# EAGLE design project_vostok_(tv_b_gone_extended)_v1.1 (EAGLE 9.2.0)
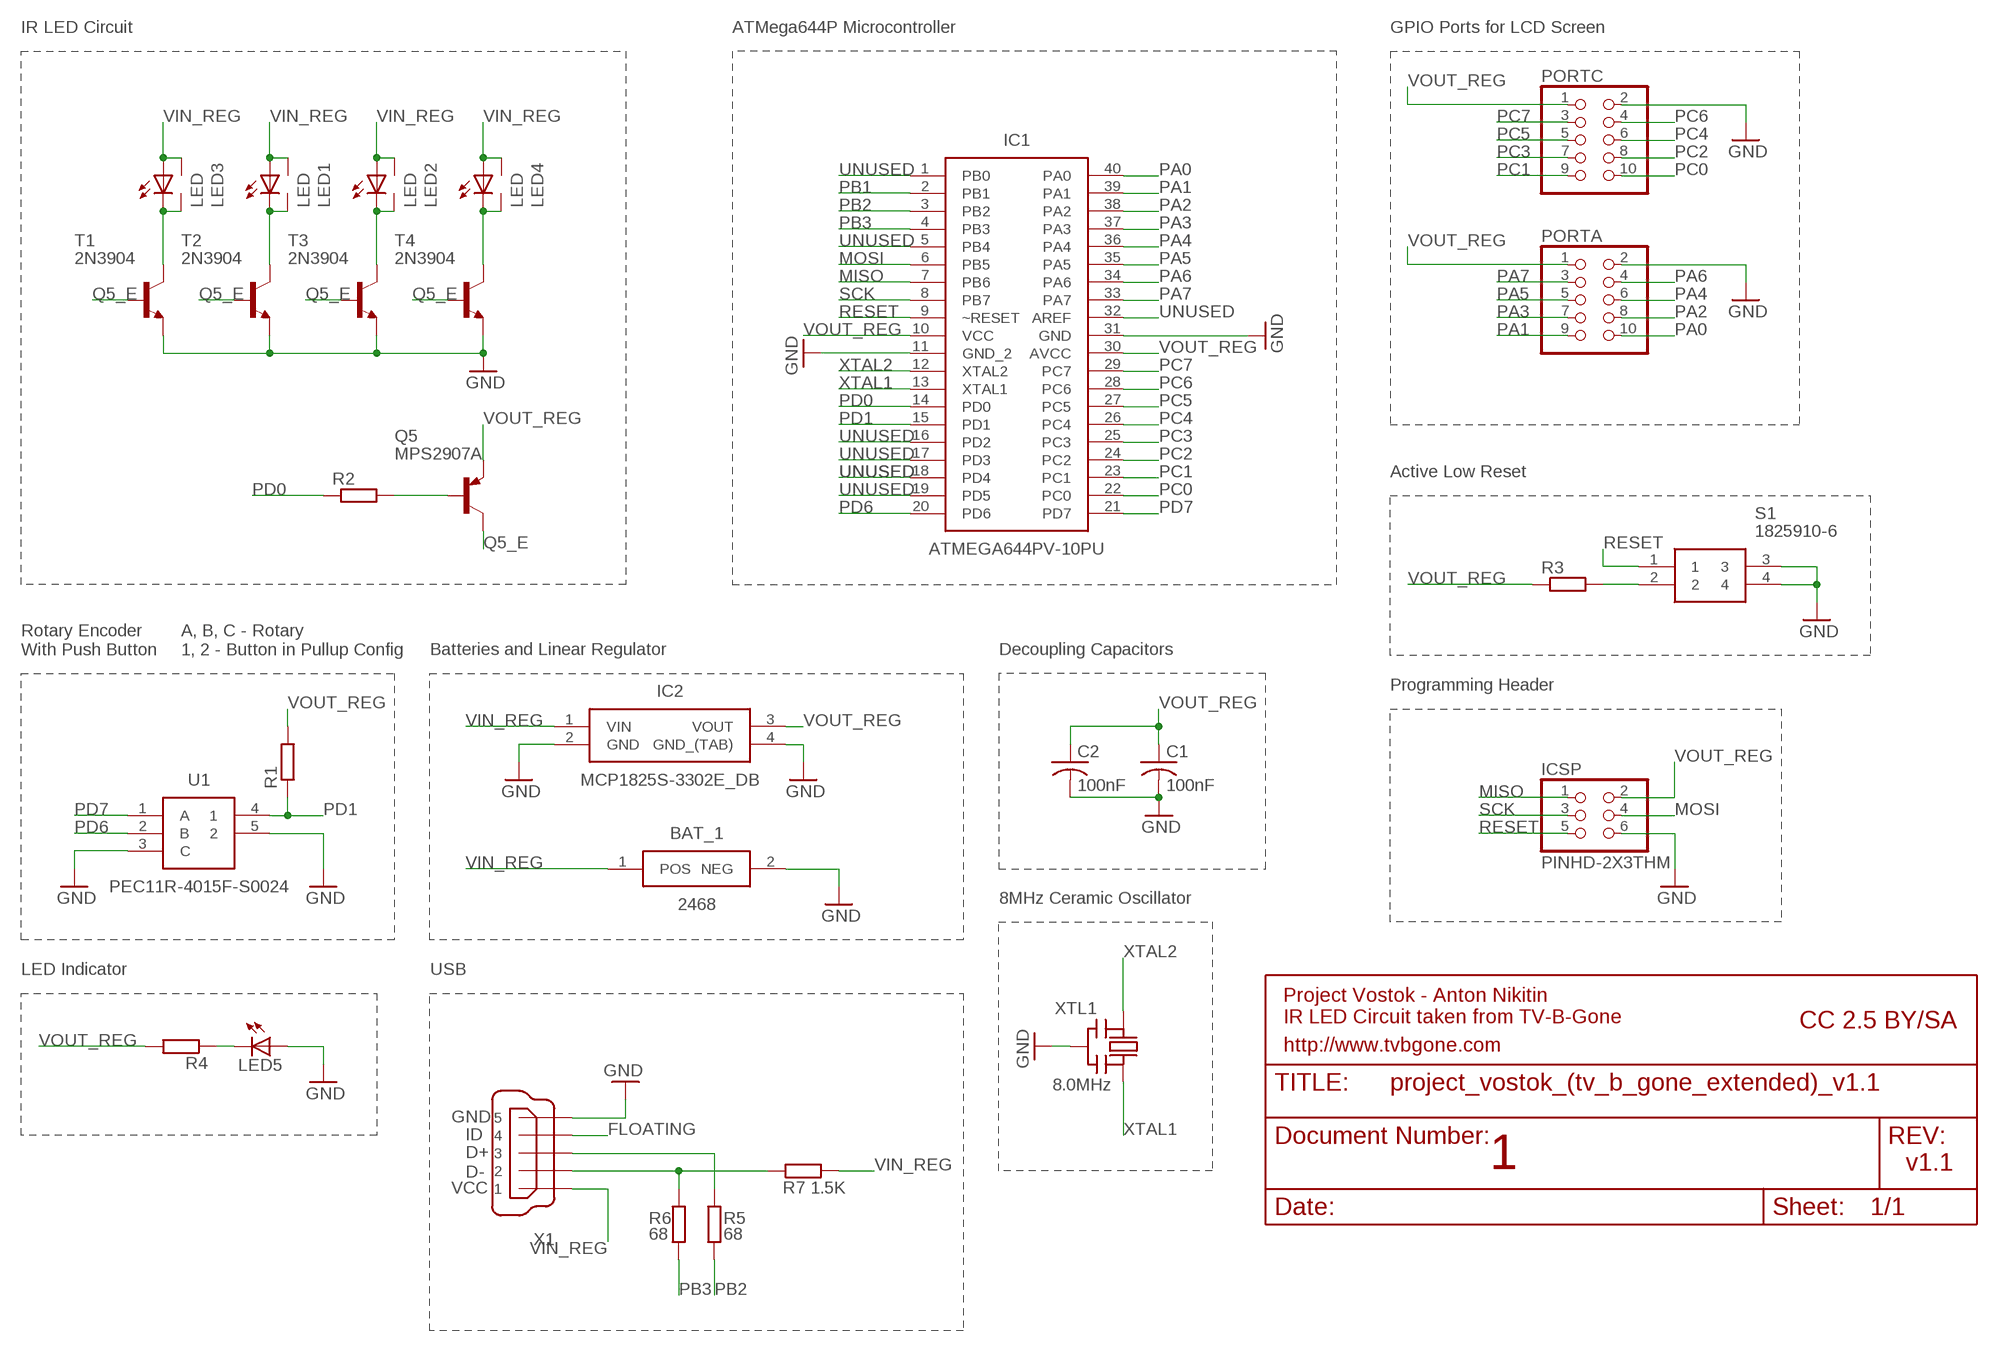
[diagram p0: schematic, sheet 1]

## Parts
BAT_1  2468  [2468]
C1  100nF  C-US025-025X050  [C025-025X050]
C2  100nF  C-US025-025X050  [C025-025X050]
IC1  ATMEGA644PV-10PU  [DIP254P1524X483-40]
IC2  MCP1825S-3302E_DB  [SOT230P700X180-4N]
ICSP  PINHD-2X3THM  [ISP6]
LED1  LED  [5MM-SIDE]
LED2  LED  [5MM-SIDE]
LED3  LED  [5MM-SIDE]
LED4  LED  [5MM-SIDE]
LED5  LED5MM  [LED5MM]
PORTA  PINHD-2X5  [2X05]
PORTC  PINHD-2X5  [2X05]
Q5  MPS2907A  [TO92-CBE]
R1  R-EU_0204/7  [0204/7]
R2  R-EU_0204/7  [0204/7]
R3  R-EU_0204/7  [0204/7]
R4  R-EU_0204/7  [0204/7]
R5  68  R-EU_0204/7  [0204/7]
R6  68  R-EU_0204/7  [0204/7]
R7  1.5K  R-EU_0204/7  [0204/7]
S1  1825910-6  [1825910-6]
T1  2N3904  [TO92]
T2  2N3904  [TO92]
T3  2N3904  [TO92]
T4  2N3904  [TO92]
U1  PEC11R-4015F-S0024  [PEC12R-4XXXF-SXXXX_1]
X1  MINI-USB_SHIELD5P2-32005-601  [32005-601]
XTL1  8.0MHz  CERMOSCILL  [CERM_OSC]

## Nets
GND: BAT_1.2(NEG) C1.2 C2.2 IC1.11(GND_2) IC1.31(GND) IC2.2(GND) IC2.4(GND_(TAB)) ICSP.6 LED5.A PORTA.2 PORTC.2 S1.3 S1.4 T1.3(E) T2.3(E) T3.3(E) T4.3(E) U1.3(C) U1.5 X1.5 XTL1.P$2(GND)
MISO: IC1.7(PB6) ICSP.1
MOSI: IC1.6(PB5) ICSP.4
N$1: IC1.1(PB0)
N$2: R5.1 X1.3
N$3: LED5.K(C) R4.1
N$4: R3.2 S1.2
N$5: X1.4
N$6: R6.1 R7.1 X1.2
N$7: Q5.B R2.2
N$13: IC1.16(PD2)
N$14: IC1.17(PD3)
N$15: IC1.18(PD4)
N$16: IC1.19(PD5)
N$18: IC1.32(AREF)
PA0: IC1.40(PA0) PORTA.10
PA1: IC1.39(PA1) PORTA.9
PA2: IC1.38(PA2) PORTA.8
PA3: IC1.37(PA3) PORTA.7
PA4: IC1.36(PA4) PORTA.6
PA5: IC1.35(PA5) PORTA.5
PA6: IC1.34(PA6) PORTA.4
PA7: IC1.33(PA7) PORTA.3
PB2: IC1.3(PB2) R5.2
PB3: IC1.4(PB3) R6.2
PB4: IC1.5(PB4)
PC0: IC1.22(PC0) PORTC.10
PC1: IC1.23(PC1) PORTC.9
PC2: IC1.24(PC2) PORTC.8
PC3: IC1.25(PC3) PORTC.7
PC4: IC1.26(PC4) PORTC.6
PC5: IC1.27(PC5) PORTC.5
PC6: IC1.28(PC6) PORTC.4
PC7: IC1.29(PC7) PORTC.3
PD0: IC1.14(PD0) R2.1
PD1: IC1.15(PD1) R1.1 U1.4
PD6: IC1.20(PD6) U1.2(B)
PD7: IC1.21(PD7) U1.1(A)
Q5_E: Q5.C T1.2(B) T2.2(B) T3.2(B) T4.2(B)
RESET: IC1.9(~RESET) ICSP.5 S1.1
SCK: IC1.8(PB7) ICSP.3
T1_C: LED3.K2(C1) LED3.K(C) T1.1(C)
T2_C: LED1.K2(C1) LED1.K(C) T2.1(C)
T3_C: LED2.K2(C1) LED2.K(C) T3.1(C)
T4_C: LED4.K2(C1) LED4.K(C) T4.1(C)
UNUSED: IC1.2(PB1)
VIN_REG: BAT_1.1(POS) IC2.1(VIN) LED1.A LED1.A2(A1) LED2.A LED2.A2(A1) LED3.A LED3.A2(A1) LED4.A LED4.A2(A1) R7.2 X1.1
VOUT_REG: C1.1 C2.1 IC1.10(VCC) IC1.30(AVCC) IC2.3(VOUT) ICSP.2 PORTA.1 PORTC.1 Q5.E R1.2 R3.1 R4.2
XTAL1: IC1.13(XTAL1) XTL1.P$3(OUT)
XTAL2: IC1.12(XTAL2) XTL1.P$1(IN)
Unconnected: X1.M1(S1) X1.M2(S2)

## Notes on the sheet
- IR LED Circuit | ATMega644P Microcontroller | GPIO Ports for LCD Screen
- UNUSED | PA0
- PB1 | PA1
- PB2 | PA2
- PB3 | PA3
- UNUSED | PA4
- MOSI | PA5
- MISO | PA6
- SCK | PA7
- RESET | UNUSED
- VOUT_REG
- VOUT_REG
- XTAL2 | PC7
- XTAL1 | PC6
- PC5
- PC4
- UNUSED | PC3
- UNUSED | PC2
- UNUSED | UNUSED | PC1 | Active Low Reset
- UNUSED | PC0
- Rotary Encoder
  With Push Button
- A, B, C - Rotary
  1, 2 - Button in Pullup Config
- Batteries and Linear Regulator | Decoupling Capacitors
- Programming Header
- 8MHz Ceramic Oscillator
- LED Indicator | USB
- Project Vostok - Anton Nikitin
  IR LED Circuit taken from TV-B-Gone
- CC 2.5 BY/SA
- http://www.tvbgone.com
- GND
- FLOATING
- ID
- D+
- 1 | v1.1
- D-
- VCC

## Library data of the parts
BAT_1 = SamacSys_Parts:2468: Cylindrical Battery Contacts, Clips, Holders & Springs 2AAA PC MNT HOLDER <https://componentsearchengine.com/Images/1/2468.jpg> Source: Datasheet <http://docs-europe.electrocomponents.com/webdocs/002e/0900766b8002ef75.pdf>; ALLIED_NUMBER: 70182756; DESCRIPTION: Cylindrical Battery Contacts, Clips, Holders & Springs 2AAA PC MNT HOLDER; HEIGHT: mm; MANUFACTURER_NAME: Keystone Electronics; MANUFACTURER_PART_NUMBER: 2468; RS_PART_NUMBER: 2794965; SUPPLIER_NAME: RS
C1 C2 = rcl-ez:C-US: CAPACITOR, American symbol
IC1 = SamacSys_Parts:ATMEGA644PV-10PU: 8-bit Microcontroller with In-System Programmable Flash <https://componentsearchengine.com/Images/1/ATMEGA644PV-10PU.jpg> Source: Datasheet <http://componentsearchengine.com/Datasheets/1/ATMEGA644PV-10PU.pdf>; DESCRIPTION: 8-bit Microcontroller with In-System Programmable Flash; HEIGHT: mm; MANUFACTURER_NAME: Microchip; MANUFACTURER_PART_NUMBER: ATMEGA644PV-10PU; RS_PART_NUMBER: 7380491P; SUPPLIER_NAME: RS
IC2 = SamacSys_Parts:MCP1825S-3302E_DB: LDO Regulator 500mA 3.3V SOT223-3 Microchip MCP1825S-3302E/DB, LDO Voltage Regulator, 0.5A, 3.3 V 0.5%, 2.1 6 Vin, 4-Pin SOT-223 <https://componentsearchengine.com/Images/3/MCP1825S-3302E_DB.jpg> Source: Datasheet <http://docs-europe.electrocomponents.com/webdocs/137e/0900766b8137ed40.pdf>; ALLIED_NUMBER: 70046538; DESCRIPTION: LDO Regulator 500mA 3.3V SOT223-3 Microchip MCP1825S-3302E/DB, LDO Voltage Regulator, 0.5A, 3.3 V 0.5%, 2.1 6 Vin, 4-Pin SOT-223; HEIGHT: 1.8mm; MANUFACTURER_NAME: Microchip; MANUFACTURER_PART_NUMBER: MCP1825S-3302E/DB; RS_PART_NUMBER: 9115520; SUPPLIER_NAME: RS
ICSP = adaprog:PINHD-2X3
LED1-LED4 = tvbgone:LED
LED5 = adafruit:LED: LED OSRAM: - CHIPLED LG R971, LG N971, LY N971, LG Q971, LY Q971, LO R971, LY R971 LH N974, LH R974 LS Q976, LO Q976, LY Q976 LO Q996 - Hyper CHIPLED LW Q18S LB Q993, LB Q99A, LB R99A - SideLED LS A670, LO A670, LY A670, LG A670, LP A670 LB A673, LV A673, LT A673, LW A673 LH A674 LY A675 LS A676, LA A676, LO A676, LY A676, LW A676 LS A679, LY A679, LG A679 - Hyper Micro SIDELED® LS Y876, LA Y876, LO Y876, LY Y876 LT Y87S - SmartLED LW L88C, LW L88S LB L89C, LB L89S, LG L890 LS L89K, LO L89K, LY L89K LS L896, LA L896, LO L896, LY L896 - TOPLED LS T670, LO T670, LY T670, LG T670, LP T670 LSG T670, LSP T670, LSY T670, LOP T670, LYG T670 LG T671, LOG T671, LSG T671 LB T673, LV T673, LT T673, LW T673 LH T674 LS T676, LA T676, LO T676, LY T676, LB T676, LH T676, LSB T676, LW T676 LB T67C, LV T67C, LT T67C, LS T67K, LO T67K, LY T67K, LW E67C LS E67B, LA E67B, LO E67B, LY E67B, LB E67C, LV E67C, LT E67C LW T67C LS T679, LY T679, LG T679 LS T770, LO T770, LY T770, LG T770, LP T770 LB T773, LV T773, LT T773, LW T773 LH T774 LS E675, LA E675, LY E675, LS T675 LS T776, LA T776, LO T776, LY T776, LB T776 LHGB T686 LT T68C, LB T68C - Hyper Mini TOPLED® LB M676 - Mini TOPLED Santana® LG M470 LS M47K, LO M47K, LY M47K Source: http://www.osram.convergy.de/
PORTA PORTC = pinhead:PINHD-2X5: PIN HEADER
Q5 = transistor-pnp:MPS2907*: PNP Transistror
R1-R7 = rcl:R-EU_: RESISTOR, European symbol; SPICEPREFIX: R
S1 = SamacSys_Parts:1825910-6: TE CONNECTIVITY / ALCOSWITCH - 1825910-6 - TACT SWITCH, SPST, 0.05A, 24VDC, SOLDER Source: Datasheet <http://www.farnell.com/datasheets/921681.pdf>; DESCRIPTION: TE CONNECTIVITY / ALCOSWITCH - 1825910-6 - TACT SWITCH, SPST, 0.05A, 24VDC, SOLDER; HEIGHT: mm; MANUFACTURER_NAME: TE Connectivity; MANUFACTURER_PART_NUMBER: 1825910-6; RS_PART_NUMBER: 1613779; SUPPLIER_NAME: RS
T1-T4 = transistor:2N3904: NPN TRANSISTOR
U1 = SamacSys_Parts:PEC11R-4015F-S0024: Bourns 24 Pulse Incremental Mechanical Rotary Encoder with a 6 mm Flat Shaft (Not Indexed), Through Hole <https://componentsearchengine.com/Images/3/PEC11R-4015F-S0024.jpg> Source: Datasheet <https://www.bourns.com/docs/Product-Datasheets/pec11R.pdf>; DESCRIPTION: Bourns 24 Pulse Incremental Mechanical Rotary Encoder with a 6 mm Flat Shaft (Not Indexed), Through Hole; HEIGHT: mm; MANUFACTURER_NAME: Bourns; MANUFACTURER_PART_NUMBER: PEC11R-4015F-S0024; RS_PART_NUMBER: 7377739P; SUPPLIER_NAME: RS
X1 = con-cypressindustries:MINI-USB_SHIELD5P2-: MINI USB-B R/A DIP 5pol. Source: www.cypressindustries.com; OC_FARNELL: unknown; OC_NEWARK: unknown
XTL1 = digg:CERMOSCILL

## Board
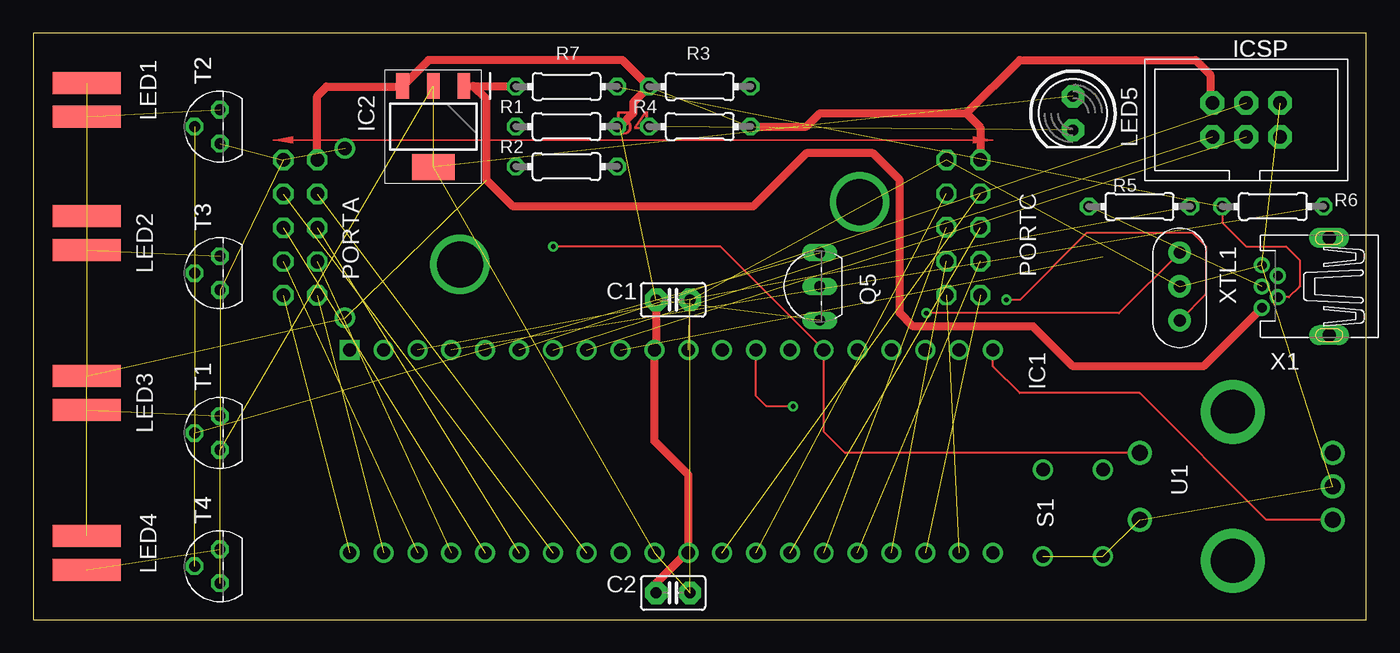
[diagram p1: board, top side]
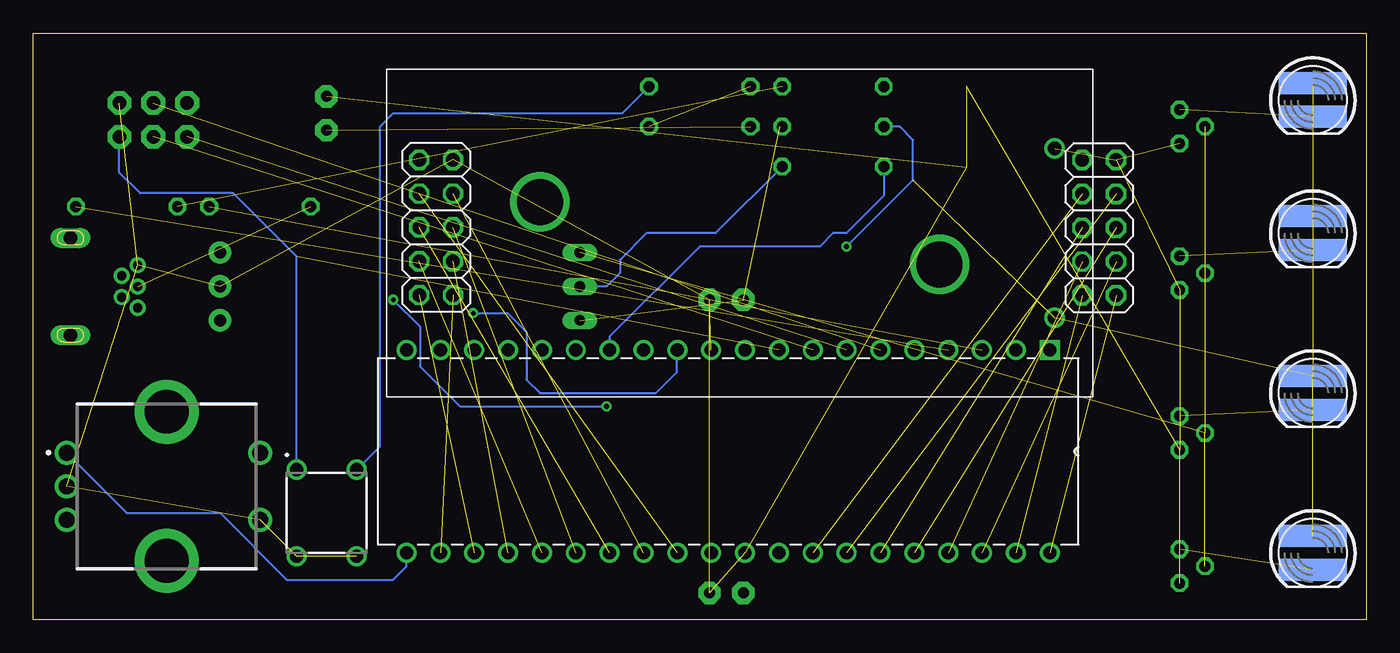
[diagram p2: board, bottom side, seen from below]

Size 100 x 44 mm. Coordinates in mm from the lower left corner, seen from the top.
Outline: 0,0 100,0 100,44 0,44 0,0
Copper layers (1*16): Top 0.035mm / dielectric 1.5mm / Bottom 0.035mm
Design rules "default": minimum track width 6mil, minimum drill 0.35mm, track to track 6mil, track to pad 6mil, pad to pad 6mil, via to via 6mil, smd to smd 6mil, copper to edge 40mil, drill to drill 6mil, minimum pad ring 10mil, minimum via ring 8mil, stop-mask expansion 4mil, vias tented up to drill 0mil, thermal gap 10mil

### Footprints (pad centres in the part's own frame; a part is rotated, then mirrored left to right if it is on the bottom)
2468 = drill 1.02 pad 1.53: 1 23.625,-6.35; 2 23.625,6.35 | drill 3.45 pad 3.45: 3 -14.985,2.35; 4 14.985,-2.35
C025-025X050 = drill 0.813 pad 1.676 octagon: 1 -1.27,0; 2 1.27,0
DIP254P1524X483-40 = drill 0.991 pad 1.486 square: 1 -15.24,48.26 | drill 0.991 pad 1.486: 2 -15.24,45.72; 3 -15.24,43.18; 4 -15.24,40.64; 5 -15.24,38.1; 6 -15.24,35.56; 7 -15.24,33.02; 8 -15.24,30.48; 9 -15.24,27.94; 10 -15.24,25.4; 11 -15.24,22.86; 12 -15.24,20.32; 13 -15.24,17.78; 14 -15.24,15.24; 15 -15.24,12.7; 16 -15.24,10.16; 17 -15.24,7.62; 18 -15.24,5.08; 19 -15.24,2.54; 20 -15.24,0; 21 0,0; 22 0,2.54; 23 0,5.08; 24 0,7.62; 25 0,10.16; 26 0,12.7; 27 0,15.24; 28 0,17.78; 29 0,20.32; 30 0,22.86; 31 0,25.4; 32 0,27.94; 33 0,30.48; 34 0,33.02; 35 0,35.56; 36 0,38.1; 37 0,40.64; 38 0,43.18; 39 0,45.72; 40 0,48.26
SOT230P700X180-4N = smd 1.95 x 0.95: 1 -3.05,2.3; 2 -3.05,0; 3 -3.05,-2.3 | smd 1.95 x 3.2: 4 3.05,0
ISP6 = drill 1.016 pad 1.778 octagon: 1 -2.54,-1.27; 2 -2.54,1.27; 3 0,-1.27; 4 0,1.27; 5 2.54,-1.27; 6 2.54,1.27
5MM-SIDE = smd 1.651 x 5.08: A -1.27,0; K 1.27,0 | smd 1.651 x 5.08 bottom: A2 -1.27,0; K2 1.27,0
LED5MM = drill 0.813 pad 1.676 octagon: A -1.27,0; K 1.27,0
2X05 = drill 1.016 octagon: 1 -5.08,-1.27; 2 -5.08,1.27; 3 -2.54,-1.27; 4 -2.54,1.27; 5 0,-1.27; 6 0,1.27; 7 2.54,-1.27; 8 2.54,1.27; 9 5.08,-1.27; 10 5.08,1.27
TO92-CBE = drill 0.813 long: B 0,0; C 2.54,0; E -2.54,0
0204/7 = drill 0.813 octagon: 1 -3.81,0; 2 3.81,0
1825910-6 = drill 1 pad 1.5: 1 3.25,2.25; 2 3.25,-2.25; 3 -3.25,2.25; 4 -3.25,-2.25
TO92 = drill 0.813 octagon: 1 1.27,0; 2 0,1.905; 3 -1.27,0
PEC12R-4XXXF-SXXXX_1 = drill 1.2 pad 1.8: 1 -2.5,-7.5; 2 2.5,-7.5; 3 0,-7.5; 4 -2.5,7; 5 2.5,7 | drill 3.28 pad 4.8: 6 5.6,0; 7 -5.6,0
32005-601 = drill 0.7 pad 1.016: 1 2.825,1.6; 2 1.625,0.8; 3 2.825,0; 4 1.625,-0.8; 5 2.825,-1.6 | drill 1 pad 1.422 long: M1 -2.225,3.65; M2 -2.225,-3.65
CERM_OSC = drill 0.9 pad 1.676: P$1 -2.54,0; P$2 0,0; P$3 2.54,0

### Placement (x,y rotation side)
BAT_1  47,29 0 bottom
C1  48,24 0 top
C2  48,2 0 top
IC1  72,5 270 bottom
IC2  30,37 270 top
ICSP  91,37.5 0 top
LED1  4,39 270 bottom
LED2  4,29 270 bottom
LED3  4,17 270 bottom
LED4  4,5 270 bottom
LED5  78,38 270 top
PORTA  20.03,29.41 270 bottom
PORTC  69.78,29.43 270 bottom
Q5  59,25 90 top
R1  40,37 0 top
R2  40,34 0 top
R3  50,40 0 top
R4  50,37 0 top
R5  83,31 0 top
R6  93,31 0 top
R7  40,40 180 top
S1  78,8 90 bottom
T1  14,14 90 top
T2  14,37 90 top
T3  14,26 90 top
T4  14,4 90 top
U1  90,10 270 bottom
X1  95,25 180 top
XTL1  86,25 270 top

### Tracks (layer width: path | path; a pad name or v marks a point on that pad's centre or on a via)
GND  (20 unrouted)
MISO  (1 unrouted)
MOSI  (1 unrouted)
N$2  (1 unrouted)
N$3  (1 unrouted)
N$4
  Bottom 0.152: S1.2 74,13 74,37 73,38 55.81,38 R3.2
N$6  (1 unrouted)
  Top 0.152: R6.1 89.19,29.81 91,28 94,28 95,27 95,25 94.2,24.2 X1.2
N$7
  Bottom 0.152: R2.2 48.81,29 54,29 56,27 56,26 57,25 Q5.B
PA0  (1 unrouted)
PA1  (1 unrouted)
PA2  (1 unrouted)
PA3  (1 unrouted)
PA4  (1 unrouted)
PA5  (1 unrouted)
PA6  (1 unrouted)
PA7  (1 unrouted)
PB2  (1 unrouted)
PB3  (1 unrouted)
PC0  (1 unrouted)
PC1  (1 unrouted)
PC2  (1 unrouted)
PC3  (1 unrouted)
PC4  (1 unrouted)
PC5  (1 unrouted)
PC6  (1 unrouted)
PC7  (1 unrouted)
PD0
  Bottom 0.152: R2.1 36.19,31.81 39,29 40,29 41,28 50,28 56.76,21.24 IC1.14
PD1  (via drill 0.35)
  Top 0.152: U1.4 60.9,12.5 59.3,14.1 IC1.15 51.54,28 v39,28
  Bottom 0.152: v39,28 34,33 34,36 35,37 R1.1
PD6
  Top 0.152: U1.2 92.5,7.5 83,17 74,17 72,19 IC1.20
PD7
  Bottom 0.152: U1.1 93,8 86,8 81,3 73,3 72,4 IC1.21
Q5_E  (4 unrouted)
RESET  (1 unrouted)
  Bottom 0.152: S1.1 80.25,27.25 85,32 92,32 93.54,33.54 ICSP.5
SCK  (1 unrouted)
T1_C  (2 unrouted)
T2_C  (2 unrouted)
T3_C  (2 unrouted)
T4_C  (2 unrouted)
VIN_REG  (9 unrouted)
  Top 0.61: IC2.1 33,40.05 | 33,40.05 36.14,40.05 R7.2 | X1.1 87.78,19 78,19 75,22 66,22 65,23 65,33 63,35 58,35 54,31 36,31 34,33 34,39.05 33,40.05
VOUT_REG  (3 unrouted)
  Top 0.61: C2.1 46.73,2.73 49,5 IC1.30 49.14,10.86 46.6,13.4 IC1.10 46.73,20.37 C1.1 | PORTA.1 21.3,39.3 22,40 27.65,40 IC2.3 29.65,42 44.19,42 R3.1 45,38.81 45,38 44,37 R1.2 | R4.2 58,37 59,38 70,38 | PORTC.1 71.05,36.95 70,38 | 70,38 74,42 87.2,42 88.3,40.9 88.3,38.93 ICSP.2
XTAL1  (via drill 0.35)
  Top 0.152: XTL1.P$3 88,24.46 88,28 87,29 79,29 74,24 v73,24 | v57,16 55,16 54.22,16.78 IC1.13
  Bottom 0.152: v73,24 71,22 71,19 68,16 v57,16
XTAL2  (via drill 0.35)
  Top 0.152: XTL1.P$1 81.46,23 v67,23
  Bottom 0.152: v67,23 64.4,23 63,21.6 63,18 62,17 53.3,17 51.7,18.6 51.7,20.22 IC1.12
(copper drawn outside any net)
  shapes: Top area x1